# Altium project Metlino.PrjPcb (part 7 of 13)

## Sheet Metlino_CLK_Distribution.SchDoc: Metlino
size 420 x 297 mm; CheckedBy: P.Kulik,T.Przywozki,W.Ruclo; Author: G.Kasprowicz; CompanyName: WUT ISE; DrawnBy: G.Kasprowicz; Organization: WUT ISE; Address1: PW ISE; Address2: Nowowiejska 15/19 00-665 Warsaw; Address3: gkasprow@gmail.com; DocumentNumber: 13; Revision: 2; SheetNumber: 13; SheetTotal: 29; ModifiedBy: -; CheckedDate: -; Title2: Clock distribution; DivGrp: WUT ISE; Designer: G.Kasprowicz; ModifiedDate: -; ProjectName: Sensor Box
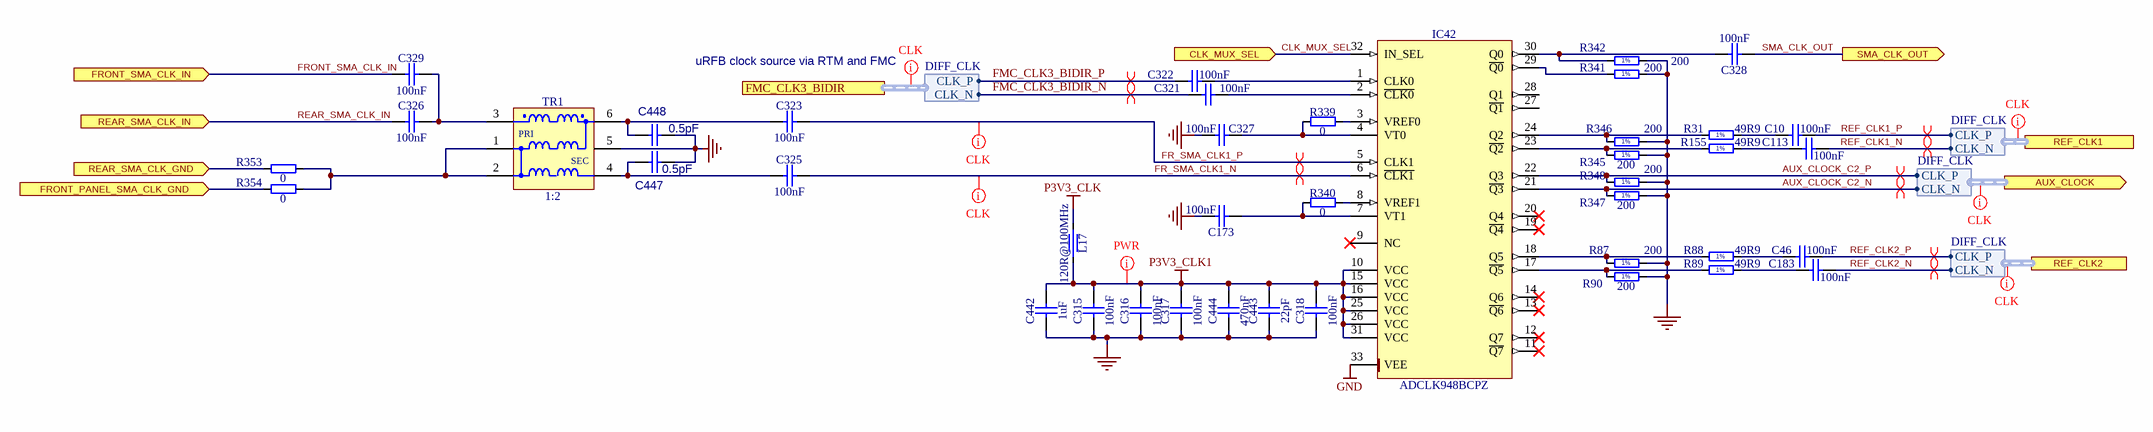
[diagram p13: Metlino_CLK_Distribution.SchDoc]

### Parts
C10  100nF  [CAPC0603X33N]
C46  100nF  [CAPC0603X33N]
C113  100nF  [CAPC0603X33N]
C173  100nF  [CAPC0603X33N]
C183  100nF  [CAPC0603X33N]
C315  100nF  [CAPC0603X33N]
C316  100nF  [CAPC0603X33N]
C317  100nF  [CAPC0603X33N]
C318  100nF  [CAPC0603X33N]
C321  100nF  [CAPC0603X33N]
C322  100nF  [CAPC0603X33N]
C323  100nF  [CAPC0603X33N]
C325  100nF  [CAPC0603X33N]
C326  100nF  [CAPC0603X33N]
C327  100nF  [CAPC0603X33N]
C328  100nF  [CAPC0603X33N]
C329  100nF  [CAPC0603X33N]
C442  1uF  [CAPC1005X55N]
C443  22pF  [CAPC1005X55N]
C444  470nF  [CAPC1005X55N]
C447  0.5pF  [CAPC1005X55N]
C448  0.5pF  [CAPC1005X55N]
IC42  ADCLK948BCPZ  [QFN50P500X500X80-33N-S285]
L17  120R@100MHz  [INDC1608X95N]
R31  49R9  [RESC1005X40N]
R87  200  [RESC1005X40N]
R88  49R9  [RESC1005X40N]
R89  49R9  [RESC1005X40N]
R90  200  [RESC1005X40N]
R155  49R9  [RESC1005X40N]
R339  0  [RESC1005X40N]
R340  0  [RESC1005X40N]
R341  200  [RESC1005X40N]
R342  200  [RESC1005X40N]
R345  200  [RESC1005X40N]
R346  200  [RESC1005X40N]
R347  200  [RESC1005X40N]
R348  200  [RESC1005X40N]
R353  0  [RESC1005X40N]
R354  0  [RESC1005X40N]
TR1  1:2  [XFMR_MINI-CIRCUITS_DB1627]

### Ports
AUX_CLOCK (out, harness DIFF_CLK), CLK_MUX_SEL (in), FMC_CLK3_BIDIR (harness DIFF_CLK), FRONT_PANEL_SMA_CLK_GND (in), FRONT_SMA_CLK_IN (in), REAR_SMA_CLK_GND (in), REAR_SMA_CLK_IN (in), REF_CLK1 (harness DIFF_CLK), REF_CLK2 (harness DIFF_CLK), SMA_CLK_OUT (out)

### Harnesses
DIFF_CLK: CLK_N, CLK_P

### Nets
GND: C173.2 C315.1 C316.1 C317.1 C318.1 C327.2 C442.2 C443.1 C444.1 C447.2 C448.2 IC42.33(VEE) R87.2 R90.2 R341.2 R342.2 R345.2 R346.2 R347.2 R348.2 TR1.5(NC)
P3V3_CLK: L17.1
P3V3_CLK1: C315.2 C316.2 C317.2 C318.2 C442.1 C443.2 C444.2 IC42.10(VCC) IC42.15(VCC) IC42.16(VCC) IC42.25(VCC) IC42.26(VCC) IC42.31(VCC) L17.2
AUX_CLOCK_C2_N: IC42.21(~{Q3}) R347.1 ; port AUX_CLOCK.CLK_N
AUX_CLOCK_C2_P: IC42.22(Q3) R348.1 ; port AUX_CLOCK.CLK_P
CLK_MUX_SEL: IC42.32(IN_SEL) ; port CLK_MUX_SEL
FMC_CLK3_BIDIR_N: C321.2 ; port FMC_CLK3_BIDIR.CLK_N  [project net CLK3_BIDIR_N]
FMC_CLK3_BIDIR_P: C322.2 ; port FMC_CLK3_BIDIR.CLK_P  [project net CLK3_BIDIR_P]
FR_SMA_CLK1_N: C325.2 IC42.6(~{CLK1})
FR_SMA_CLK1_P: C323.2 IC42.5(CLK1)
FRONT_PANEL_SMA_CLK_GND: R354.1 ; port FRONT_PANEL_SMA_CLK_GND
FRONT_SMA_CLK_IN: C329.1 ; port FRONT_SMA_CLK_IN
REAR_SMA_CLK_GND: R353.1 ; port REAR_SMA_CLK_GND
REAR_SMA_CLK_IN: C326.1 ; port REAR_SMA_CLK_IN
REF_CLK1_N: C113.1 ; port REF_CLK1.CLK_N
REF_CLK1_P: C10.1 ; port REF_CLK1.CLK_P
REF_CLK2_N: C183.1 ; port REF_CLK2.CLK_N
REF_CLK2_P: C46.1 ; port REF_CLK2.CLK_P
SMA_CLK_OUT: C328.1 ; port SMA_CLK_OUT
NetC10_2: C10.2 R31.2
NetC46_2: C46.2 R88.2
NetC113_2: C113.2 R155.2
NetC173_1: C173.1 IC42.7(VT1) R340.1
NetC183_2: C183.2 R89.2
NetC321_1: C321.1 IC42.2(~{CLK0})
NetC322_1: C322.1 IC42.1(CLK0)
NetC323_1: C323.1 C448.1 TR1.6(S1)
NetC325_1: C325.1 C447.1 TR1.4(S1)
NetC326_2: C326.2 C329.2 TR1.3(P1)
NetC327_1: C327.1 IC42.4(VT0) R339.1
NetC328_2: C328.2 IC42.30(Q0) R342.1
NetIC42_3: IC42.3(VREF0) R339.2
NetIC42_8: IC42.8(VREF1) R340.2
NetIC42_17: IC42.17(~{Q5}) R89.1 R90.1
NetIC42_18: IC42.18(Q5) R87.1 R88.1
NetIC42_23: IC42.23(~{Q2}) R155.1 R345.1
NetIC42_24: IC42.24(Q2) R31.1 R346.1
NetIC42_29: IC42.29(~{Q0}) R341.1
NetR353_2: R353.2 R354.2 TR1.1(P1) TR1.2(P1)

Not connected (* = marked no-connect by the designer): IC42 9(NC)* 11(~{Q7})* 12(Q7)* 13(~{Q6})* 14(Q6)* 19(~{Q4})* 20(Q4)* 27(~{Q1}) 28(Q1)

### Layout directives
differential pair: AUX_CLOCK_C2_N, AUX_CLOCK_C2_P, CLK3_BIDIR_N, CLK3_BIDIR_P, FR_SMA_CLK1_N, FR_SMA_CLK1_P, REF_CLK1_N, REF_CLK1_P, REF_CLK2_N, REF_CLK2_P
net class CLK: (no net found under the mark), FR_SMA_CLK1_N, FR_SMA_CLK1_P
net class PWR: P3V3_CLK1

### Notes on the sheet
- uRFB clock source via RTM and FMC
- Project/Equipment
- Document
- Designer
- Drawn by
- Check.by
- Copyright WUT ISE 2018.
  This documentation describes Open Hardware and is licensed under the CERN OHL v.1.1. You may redistribute and modify this documentation under the terms of the CERN OHL v.1.1. (http://ohwr.org/CERNOHL). This documentation is distributed WITHOUT ANY EXPRESS OR IMPLIED WARRANTY, INCLUDING OF MERCHANTABILITY, SATISFACTORY QUALITY AND FITNESS FOR A PARTICULAR PURPOSE. Please see the CERN OHL v.1.1 for applicable conditions.
- Contact
- File
- Last Mod.
- Print Date
- Sheet
- Size
- A3
- of
- Rev
- (in symbol R0402_49R9_1%_0.0625W_100PPM) 1%
- (in symbol R0402_200R_1%_0.0625W_100PPM) 1%
- (in symbol XFMR_MINI-CIRCUITS_TCM2-43X+) PRI; SEC

### Library data of the parts
C10 C46 C113 C173 C183 C315-C318 C321-C323 C325-C329 = CC0201_100NF_6.3V_10%_X5R: Non-polarised capacitor; Manufacturer: GENERIC; Part Description: SMD Multilayer Chip Ceramic Capacitor; Manufacturer1 Part Number: 02016D104KAT2A; Tolerance: ±10%; Voltage: 6.3V; TC: X5R; Manufacturer Part Number: CC0201_100NF_6.3V_10%_X5R; Part Number: CC0201_100NF_6.3V_10%_X5R; Value: 100nF; Component Kind: Standard; Component Type: Standard; Pin Count: 2; Status: Not Recommended; Case: 0201; Mounted: Yes; Socket: No; SMD: Yes; Sense: No; Manufacturer1 Example: AVX; Manufacturer1 ComponentHeight: 0.33mm; HelpURL: \\cern.ch\dfs\Applications\Altium\Datasheets\CC0201_X5R_AVX.pdf; Author: CERN DEM JLC; CreateDate: 03.12.2007; LatestRevisionDate: 03.12.2007
C442 = CC0402_1UF_16V_10%_X5R: as C215-C218 on sheet PWR_DC_DC_EXAR; Manufacturer Part Number: CC0402_1UF_16V_10%_X5R; Part Number: CC0402_1UF_16V_10%_X5R; Value: 1uF; Component Kind: Standard; Component Type: Standard; Pin Count: 2; Status: Preferred; Case: 0402; Mounted: Yes; Socket: No; SMD: Yes; Sense: No; Manufacturer1 Example: TDK; Manufacturer1 ComponentHeight: 0.55mm; HelpURL: \\cern.ch\dfs\Applications\Altium\Datasheets\CC0402_X5R_TDK_C.pdf; Author: CERN DEM JLC; CreateDate: 25.10.2012; LatestRevisionDate: 25.10.2012
C443 = CC0402_22PF_50V_5%_C0G: Non-polarised capacitor; Manufacturer: GENERIC; Part Description: SMD Multilayer Chip Ceramic Capacitor; Manufacturer1 Part Number: C0402C220J5GACTU; Tolerance: ±5%; Voltage: 50V; TC: C0G/NP0; Manufacturer Part Number: CC0402_22PF_50V_5%_C0G; Part Number: CC0402_22PF_50V_5%_C0G; Value: 22pF; Component Kind: Standard; Component Type: Standard; Pin Count: 2; Status: Preferred; Case: 0402; Mounted: Yes; Socket: No; SMD: Yes; Sense: No; Manufacturer1 Example: KEMET; Manufacturer1 ComponentHeight: 0.55mm; HelpURL: \\cern.ch\dfs\Applications\Altium\Datasheets\CC0805_C0G_KEMET_(Commercial Grade).pdf; Author: CERN DEM JLC; CreateDate: 03.12.2007; LatestRevisionDate: 03.12.2007
C444 = CC0402_470NF_16V_10%_X5R: Non-polarised capacitor; Manufacturer: GENERIC; Part Description: SMD Multilayer Chip Ceramic Capacitor; Manufacturer1 Part Number: C1005X5R1C105KT; Tolerance: ±10%; Voltage: 16V; TC: X5R; Manufacturer Part Number: CC0402_470NF_16V_10%_X5R; Part Number: CC0402_470NF_16V_10%_X5R; Value: 470nF; Component Kind: Standard; Component Type: Standard; Pin Count: 2; Status: Preferred; Case: 0402; Mounted: Yes; Socket: No; SMD: Yes; Sense: No; Manufacturer1 Example: TDK; Manufacturer1 ComponentHeight: 0.55mm; HelpURL: \\cern.ch\dfs\Applications\Altium\Datasheets\CC0402_X5R_TDK_C.pdf; Author: CERN DEM JLC; CreateDate: 25.10.2012; LatestRevisionDate: 25.10.2012
C447 = CAPC1005X55N: $$NotCommonProperty_General Part Number: CC0402_0.5PF_25V_0.25PF_C0G; $$NotCommonProperty_Manufacturer1 Example: AVX; $$NotCommonProperty_Manufacturer1 Part Number: 04023J0R5ABSTR; Manufacturer Part Number: CC0402_0.5PF_25V_0.05PF_C0G; Manufacturer: GENERIC; Part Description: SMD Multilayer Chip Ceramic Capacitor; Part Name: Capacitor - non polarized CAPC1005X55N; $$Internal_Resolution: 00001mm; $$NotCommonProperty_Case: 0402; $$NotCommonProperty_Pin Count: 2; $$NotCommonProperty_SMD: Yes; $$NotCommonProperty_Status: Preferred; $$NotCommonProperty_TC: C0G/NP0; $$NotCommonProperty_Voltage: 25V; CmpIndex: 53; DXDB_LIBNAME: Capacitors SMD; Ref Designator: C447; SymIndex: 331; Tolerance: ±0.05pF; Cell Name: CAPC1005X55N; Part Number: Capacitor - non polarized CAPC1005X55N; Value: 0.5pF; Orientation: 0 = 0
C448 = CAPC1005X55N: $$NotCommonProperty_General Part Number: CC0402_0.5PF_25V_0.25PF_C0G; $$NotCommonProperty_Manufacturer1 Example: AVX; $$NotCommonProperty_Manufacturer1 Part Number: 04023J0R5ABSTR; Manufacturer Part Number: CC0402_0.5PF_25V_0.05PF_C0G; Manufacturer: GENERIC; Part Description: SMD Multilayer Chip Ceramic Capacitor; Part Name: Capacitor - non polarized CAPC1005X55N; $$Internal_Resolution: 00001mm; $$NotCommonProperty_Case: 0402; $$NotCommonProperty_Pin Count: 2; $$NotCommonProperty_SMD: Yes; $$NotCommonProperty_Status: Preferred; $$NotCommonProperty_TC: C0G/NP0; $$NotCommonProperty_Voltage: 25V; CmpIndex: 57; DXDB_LIBNAME: Capacitors SMD; Ref Designator: C448; SymIndex: 331; Tolerance: ±0.05pF; Cell Name: CAPC1005X55N; Part Number: Capacitor - non polarized CAPC1005X55N; Value: 0.5pF; Orientation: 0 = 0
IC42 = ADCLK948BCPZ: Two Selectable Inputs, 8 LVPECL Outputs, SiGe Clock Fanout Buffer; Manufacturer: ANALOG DEVICES; PressFit: No; Bonding: No; Manufacturer Part Number: ADCLK948BCPZ; PackageDescription: QFN, 0.50mm Pitch, Square; 8 Pin X 8 Pin, 5mm X 5mm X 1.00mm H body (w/thermal tab 2.85 X 2.85mm),  IPC Medium Density; Part Description: Two Selectable Inputs, 8 LVPECL Outputs, SiGe Clock Fanout Buffer; Part Number: ADCLK948BCPZ; Component Kind: Standard; Component Type: Standard; Device: ADCLK948BCPZ; Pin Count: 33; Case: QFN32; Mounted: Yes; Socket: No; SMD: Yes; Sense: No; ComponentHeight: 0.8mm; Author: CERN DEM MR; HelpURL: \\cern.ch\dfs\Applications\Altium\Datasheets\ADCLK948BCPZ.pdf; CreateDate: 30.11.2016; LatestRevisionDate: 30.11.2016
L17 = IND0603_MURATA_BLM18PG121SN1D: Manufacturer: MURATA; Part Description: SMD EMIFIL Chip Ferrite Bead; Power: 2A; Resistance: 0.05R; Manufacturer Part Number: BLM18PG121SN1D; Part Number: IND0603_MURATA_BLM18PG121SN1D; Value: 120R@100MHz; Component Kind: Standard; Component Type: Standard; Pin Count: 2; Status: None; Case: 0603; Mounted: Yes; Socket: No; SMD: Yes; Sense: No; ComponentHeight: 0.95mm; HelpURL: \\cern.ch\dfs\Applications\Altium\Datasheets\IND0603_MURATA_BLM18P.pdf; Author: CERN DEM BC; CreateDate: 27.07.2015; LatestRevisionDate: 25.10.2018
R31 R88 R89 R155 = R0402_49R9_1%_0.0625W_100PPM: Resistor - 1%; Manufacturer: GENERIC; Part Description: General Purpose Thick Film Chip Resistor; Manufacturer1 Part Number: 232270674999L or RC0402FR-0749R9L; TC: ±100ppm/°C; PressFit: No; Manufacturer Part Number: R0402_49R9_1%_0.0625W_100PPM; Part Number: R0402_49R9_1%_0.0625W_100PPM; Tolerance: ±1%; Value: 49R9; Component Kind: Standard; Component Type: Standard; Pin Count: 2; Status: Not Recommended; Power: 0.0625W; Case: 0402; Mounted: Yes; Sense: No; Socket: No; SMD: Yes; Manufacturer1 Example: YAGEO PHYCOMP; Manufacturer1 ComponentHeight: 0.4mm; HelpURL: \\cern.ch\dfs\Applications\Altium\Datasheets\R0402_Phycomp_RC0402.pdf; Author: CERN DEM JLC; CreateDate: 24.10.2012; LatestRevisionDate: 24.10.2012
R87 R90 R341 R342 R345-R348 = R0402_200R_1%_0.0625W_100PPM: Resistor - 1%; Manufacturer: GENERIC; Part Description: General Purpose Thick Film Chip Resistor; Manufacturer1 Part Number: 232270672001L; TC: ±100ppm/°C; PressFit: No; Manufacturer Part Number: R0402_200R_1%_0.0625W_100PPM; Part Number: R0402_200R_1%_0.0625W_100PPM; Tolerance: ±1%; Value: 200; Component Kind: Standard; Component Type: Standard; Pin Count: 2; Status: Not Recommended; Power: 0.0625W; Case: 0402; Mounted: Yes; Sense: No; Socket: No; SMD: Yes; Manufacturer1 Example: YAGEO PHYCOMP; Manufacturer1 ComponentHeight: 0.4mm; HelpURL: \\cern.ch\dfs\Applications\Altium\Datasheets\R0402_Phycomp_RC0402.pdf; Author: CERN DEM JLC; CreateDate: 03.12.2007; LatestRevisionDate: 17.10.2012
R339 R340 R353 R354 = R0402_0R_JUMPER: Resistor; Manufacturer: GENERIC; Part Description: 1A (0.05R Max DC Resistance) Zero Ohm Jumper; Manufacturer1 Part Number: 232270591001L; PressFit: No; Manufacturer Part Number: R0402_0R_JUMPER; Part Number: R0402_0R_JUMPER; Value: 0; Component Kind: Standard; Component Type: Standard; Pin Count: 2; Status: Not Recommended; Case: 0402; Mounted: Yes; Sense: No; Socket: No; SMD: Yes; Manufacturer1 Example: YAGEO PHYCOMP; Manufacturer1 ComponentHeight: 0.4mm; HelpURL: \\cern.ch\dfs\Applications\Altium\Datasheets\R0402_Phycomp_RC0402.pdf; Author: CERN DEM JLC; CreateDate: 03.12.2007; LatestRevisionDate: 17.10.2012
TR1 = XFMR_MINI-CIRCUITS_TCM2-43X+: 50 OHMS 10 to 4000 MHz RF Transformer; Power: 0.4W; Part Number: XFMR_MINI-CIRCUITS_TCM2-43X+; Component Kind: Standard; Component Type: Standard; Pin Count: 6; Value: 1:2; Status: None; Part Description: 50 Ohms 10 to 4000MHz RF Transformer; Manufacturer: MINI-CIRCUITS; Manufacturer Part Number: TCM2-43X+; Mounted: Yes; Socket: No; Sense: No; SMD: Yes; ComponentHeight: 4.06mm; HelpURL: \\cern.ch\dfs\Applications\Altium\Datasheets\XFMR_MINI-CIRCUITS_TCM2-43X+.pdf; Author: CERN DEM BC; CreateDate: 12.02.2016; LatestRevisionDate: 12.02.2016

## Sheet Thermometers.SchDoc: Metlino
size 420 x 297 mm; CheckedBy: P.Kulik,T.Przywozki,W.Ruclo; Author: G.Kasprowicz; CompanyName: WUT ISE; DrawnBy: G.Kasprowicz; Organization: WUT ISE; Address1: PW ISE; Address2: Nowowiejska 15/19 00-665 Warsaw; Address3: gkasprow@gmail.com; DocumentNumber: 24; Revision: 2; SheetNumber: 24; SheetTotal: 29; ModifiedBy: -; CheckedDate: -; Title2: Sensors & EEPROM; DivGrp: WUT ISE; Designer: G.Kasprowicz; ModifiedDate: -; ProjectName: Sensor Box
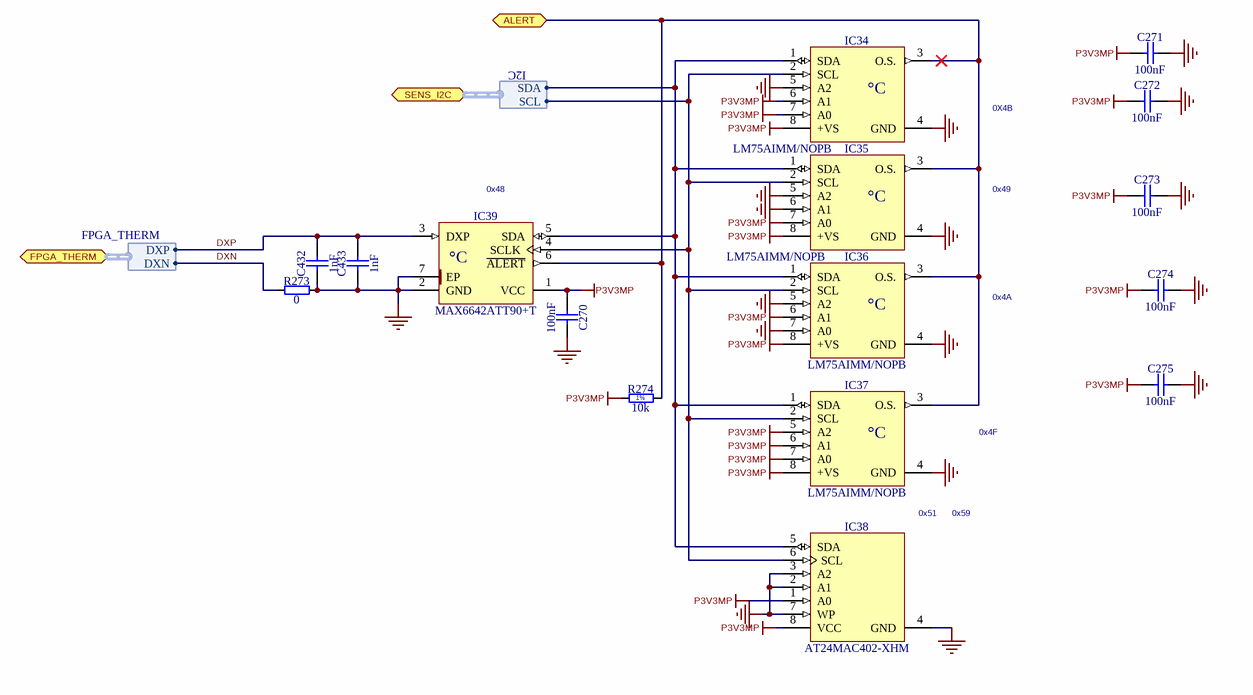
[diagram p14: Thermometers.SchDoc]

### Parts
C270  100nF  [CAPC0603X33N]
C271  100nF  [CAPC0603X33N]
C272  100nF  [CAPC0603X33N]
C273  100nF  [CAPC0603X33N]
C274  100nF  [CAPC0603X33N]
C275  100nF  [CAPC0603X33N]
C432  1nF  [CAPC1005X55N]
C433  1nF  [CAPC1005X55N]
IC34  LM75AIMM/NOPB  [SOP65P490X109-8N]
IC35  LM75AIMM/NOPB  [SOP65P490X109-8N]
IC36  LM75AIMM/NOPB  [SOP65P490X109-8N]
IC37  LM75AIMM/NOPB  [SOP65P490X109-8N]
IC38  AT24MAC402-XHM  [SOP65P640X120-8N]
IC39  MAX6642ATT90+T  [SON95P300X300X80-7N-R160X240]
R273  0  [RESC1005X40N]
R274  10k  [RESC1005X40N]

### Ports
ALERT (bidir), FPGA_THERM (bidir, harness FPGA_THERM), SENS_I2C (bidir, harness I2C)

### Harnesses
FPGA_THERM: DXP, DXN
I2C: SCL, SDA

### Nets
GND: C270.1 C271.2 C272.2 C273.2 C274.2 C275.2 C432.1 C433.1 IC34.4(GND) IC34.5(A2) IC35.4(GND) IC35.5(A2) IC35.6(A1) IC36.4(GND) IC36.5(A2) IC36.7(A0) IC37.4(GND) IC38.2(A1) IC38.3(A2) IC38.4(GND) IC38.7(WP) IC39.2(GND) IC39.7(EP) R273.2
P3V3MP: C270.2 C271.1 C272.1 C273.1 C274.1 C275.1 IC34.6(A1) IC34.7(A0) IC34.8(+VS) IC35.7(A0) IC35.8(+VS) IC36.6(A1) IC36.8(+VS) IC37.5(A2) IC37.6(A1) IC37.7(A0) IC37.8(+VS) IC38.1(A0) IC38.8(VCC) IC39.1(VCC) R274.1
DXN: R273.1 ; port FPGA_THERM.DXN
DXP: C432.2 C433.2 IC39.3(DXP) ; port FPGA_THERM.DXP
PM_I2C.SCL: IC34.2(SCL) IC35.2(SCL) IC36.2(SCL) IC37.2(SCL) IC38.6(SCL) IC39.4(SCLK) ; port SENS_I2C.SCL
PM_I2C.SDA: IC34.1(SDA) IC35.1(SDA) IC36.1(SDA) IC37.1(SDA) IC38.5(SDA) IC39.5(SDA) ; port SENS_I2C.SDA
NetIC34_3: IC34.3(O.S.) IC35.3(O.S.) IC36.3(O.S.) IC37.3(O.S.) IC39.6(~{ALERT}) R274.2 ; port ALERT

### Notes on the sheet
- 0X4B
- (near IC39) 0x48
- 0x49
- 0x4A
- 0x4F
- 0x51
- 0x59
- Project/Equipment
- Document
- Designer
- Drawn by
- Check.by
- Copyright WUT ISE 2018.
  This documentation describes Open Hardware and is licensed under the CERN OHL v.1.1. You may redistribute and modify this documentation under the terms of the CERN OHL v.1.1. (http://ohwr.org/CERNOHL). This documentation is distributed WITHOUT ANY EXPRESS OR IMPLIED WARRANTY, INCLUDING OF MERCHANTABILITY, SATISFACTORY QUALITY AND FITNESS FOR A PARTICULAR PURPOSE. Please see the CERN OHL v.1.1 for applicable conditions.
- Contact
- File
- Last Mod.
- Print Date
- Sheet
- Size
- A3
- of
- Rev
- (in symbol LM75AIMM/NOPB) °C
- (in symbol MAX6642ATT90+T) °C
- (in symbol R0402_10K_1%_0.0625W_100PPM) 1%

### Library data of the parts
C270-C275 = CC0201_100NF_6.3V_10%_X5R: as C10 on sheet Metlino_CLK_Distribution; Manufacturer Part Number: CC0201_100NF_6.3V_10%_X5R; Part Number: CC0201_100NF_6.3V_10%_X5R; Value: 100nF; Component Kind: Standard; Component Type: Standard; Pin Count: 2; Status: Not Recommended; Case: 0201; Mounted: Yes; Socket: No; SMD: Yes; Sense: No; Manufacturer1 Example: AVX; Manufacturer1 ComponentHeight: 0.33mm; HelpURL: \\cern.ch\dfs\Applications\Altium\Datasheets\CC0201_X5R_AVX.pdf; Author: CERN DEM JLC; CreateDate: 03.12.2007; LatestRevisionDate: 03.12.2007
C432 C433 = CC0402_1NF_50V_10%_X7R: Non-polarised capacitor; Manufacturer: GENERIC; Part Description: SMD Multilayer Chip Ceramic Capacitor; Manufacturer1 Part Number: 223858715623; Tolerance: ±10%; Voltage: 50V; TC: X7R; Manufacturer Part Number: CC0402_1NF_50V_10%_X7R; Part Number: CC0402_1NF_50V_10%_X7R; Value: 1nF; Component Kind: Standard; Component Type: Standard; Pin Count: 2; Status: Not Recommended; Case: 0402; Mounted: Yes; Socket: No; SMD: Yes; Sense: No; Manufacturer1 Example: PHYCOMP; Manufacturer1 ComponentHeight: 0.55mm; HelpURL: \\cern.ch\dfs\Applications\Altium\Datasheets\CC0402_X7R_PHYCOMP.pdf; Author: CERN DEM JLC; CreateDate: 03.12.2007; LatestRevisionDate: 03.12.2007
IC34-IC37 = LM75AIMM/NOPB: Digital Temperature Sensor and Thermal Watchdog with Two-Wire Interface; Manufacturer: TEXAS INSTRUMENTS; Part Description: -25° to +100°C ±2°C Digital Temperature Sensor and Thermal Watchdog with Two-Wire Interface; PressFit: No; Bonding: No; Manufacturer Part Number: LM75AIMM/NOPB; PackageDescription: SOP, 0.65mm pitch; 8 pin,3.00mm W X 3.00mm L X 1.09mm H bodyI, PC Medium Density; Part Number: LM75AIMM/NOPB; Component Kind: Standard; Component Type: Standard; Device: LM75AIMM/NOPB; Pin Count: 8; Case: SSOP8; Mounted: Yes; Socket: No; SMD: Yes; Sense: No; ComponentHeight: 1.09mm; HelpURL: \\cern.ch\dfs\Applications\Altium\Datasheets\LM75AIMM-NOPB.pdf; Author: CERN DEM JLC; CreateDate: 15.10.2012; LatestRevisionDate: 15.10.2012
IC38 = AT24MAC402-XHM: 1.7V to 5.5V, I2C-Compatible (2-wire) 2-Kbit (256 x 8) Serial EEPROM; Manufacturer: ATMEL; Part Description: 1.7V to 5.5V, I2C-Compatible (2-wire) 2-Kbit (256 x 8) Serial EEPROM with a EUI-48 Address; PressFit: No; Bonding: No; Footprint: SOP65X640X120-8N; Manufacturer Part Number: AT24MAC402-XHM; PackageDescription: SOP, 0.65mm pitch; 8 pin, 4.40mm W X 3.00mm L X 1.20mm H body, IPC Medium Density; Part Number: AT24MAC402-XHM; Component Kind: Standard; Component Type: Standard; Device: AT24MAC402-XHM; Pin Count: 8; Case: TSSOP8; Mounted: Yes; Socket: No; SMD: Yes; Sense: No; ComponentHeight: 1.2mm; HelpURL: \\cern.ch\dfs\Applications\Altium\Datasheets\AT24MAC402-XHM.pdf; Author: CERN DEM MR; CreateDate: 09.03.2016; LatestRevisionDate: 09.11.2016
IC39 = MAX6642ATT90+T: ±1°C, SMBus-Compatible Remote/Local Temperature Sensor with Overtemperature Alarm; Manufacturer: MAXIM; Part Description: 0°C to +125°C, ±1°C, SMBus-Compatible Remote/Local Temperature Sensor with Overtemperature Alarm (Address 1001 000); PressFit: No; Bonding: No; Manufacturer Part Number: MAX6642ATT90+T; PackageDescription: SON, 0.95mm Pitch; 6 Pin, 3.00mm W X 3mm L X 0.80mm H body (w/Thermal Tab 1.6mm x 2.4mm); Part Number: MAX6642ATT90+T; Component Kind: Standard; Component Type: Standard; Device: MAX6642ATT90+T; Pin Count: 7; Case: SON6; Mounted: Yes; Socket: No; SMD: Yes; Sense: No; ComponentHeight: 0.8mm; HelpURL: \\cern.ch\dfs\Applications\Altium\Datasheets\MAX6642ATT90+T.pdf; Author: CERN DEM JLC; CreateDate: 26.11.2013; LatestRevisionDate: 26.11.2013
R273 = R0402_0R_JUMPER: as R339 on sheet Metlino_CLK_Distribution; Manufacturer Part Number: R0402_0R_JUMPER; Part Number: R0402_0R_JUMPER; Value: 0; Component Kind: Standard; Component Type: Standard; Pin Count: 2; Status: Not Recommended; Case: 0402; Mounted: Yes; Sense: No; Socket: No; SMD: Yes; Manufacturer1 Example: YAGEO PHYCOMP; Manufacturer1 ComponentHeight: 0.4mm; HelpURL: \\cern.ch\dfs\Applications\Altium\Datasheets\R0402_Phycomp_RC0402.pdf; Author: CERN DEM JLC; CreateDate: 03.12.2007; LatestRevisionDate: 17.10.2012
R274 = R0402_10K_1%_0.0625W_100PPM: Resistor - 1%; Manufacturer: GENERIC; Part Description: General Purpose Thick Film Chip Resistor; Manufacturer1 Part Number: 232270671003L; TC: ±100ppm/°C; PressFit: No; Manufacturer Part Number: R0402_10K_1%_0.0625W_100PPM; Part Number: R0402_10K_1%_0.0625W_100PPM; Tolerance: ±1%; Value: 10k; Component Kind: Standard; Component Type: Standard; Pin Count: 2; Status: Not Recommended; Power: 0.0625W; Case: 0402; Mounted: Yes; Sense: No; Socket: No; SMD: Yes; Manufacturer1 Example: YAGEO PHYCOMP; Manufacturer1 ComponentHeight: 0.4mm; HelpURL: \\cern.ch\dfs\Applications\Altium\Datasheets\R0402_Phycomp_RC0402.pdf; Author: CERN DEM JLC; CreateDate: 03.12.2007; LatestRevisionDate: 17.10.2012

## Sheet VHDCI_CON.SchDoc: Metlino
size 420 x 297 mm; CheckedBy: P.Kulik,T.Przywozki,W.Ruclo; Author: G.Kasprowicz; CompanyName: WUT ISE; DrawnBy: G.Kasprowicz; Organization: WUT ISE; Address1: PW ISE; Address2: Nowowiejska 15/19 00-665 Warsaw; Address3: gkasprow@gmail.com; DocumentNumber: 14; Revision: 2; SheetNumber: 14; SheetTotal: 29; ModifiedBy: -; CheckedDate: -; Title2: VHDCI connectors; DivGrp: WUT ISE; Designer: G.Kasprowicz; ModifiedDate: -; ProjectName: Sensor Box
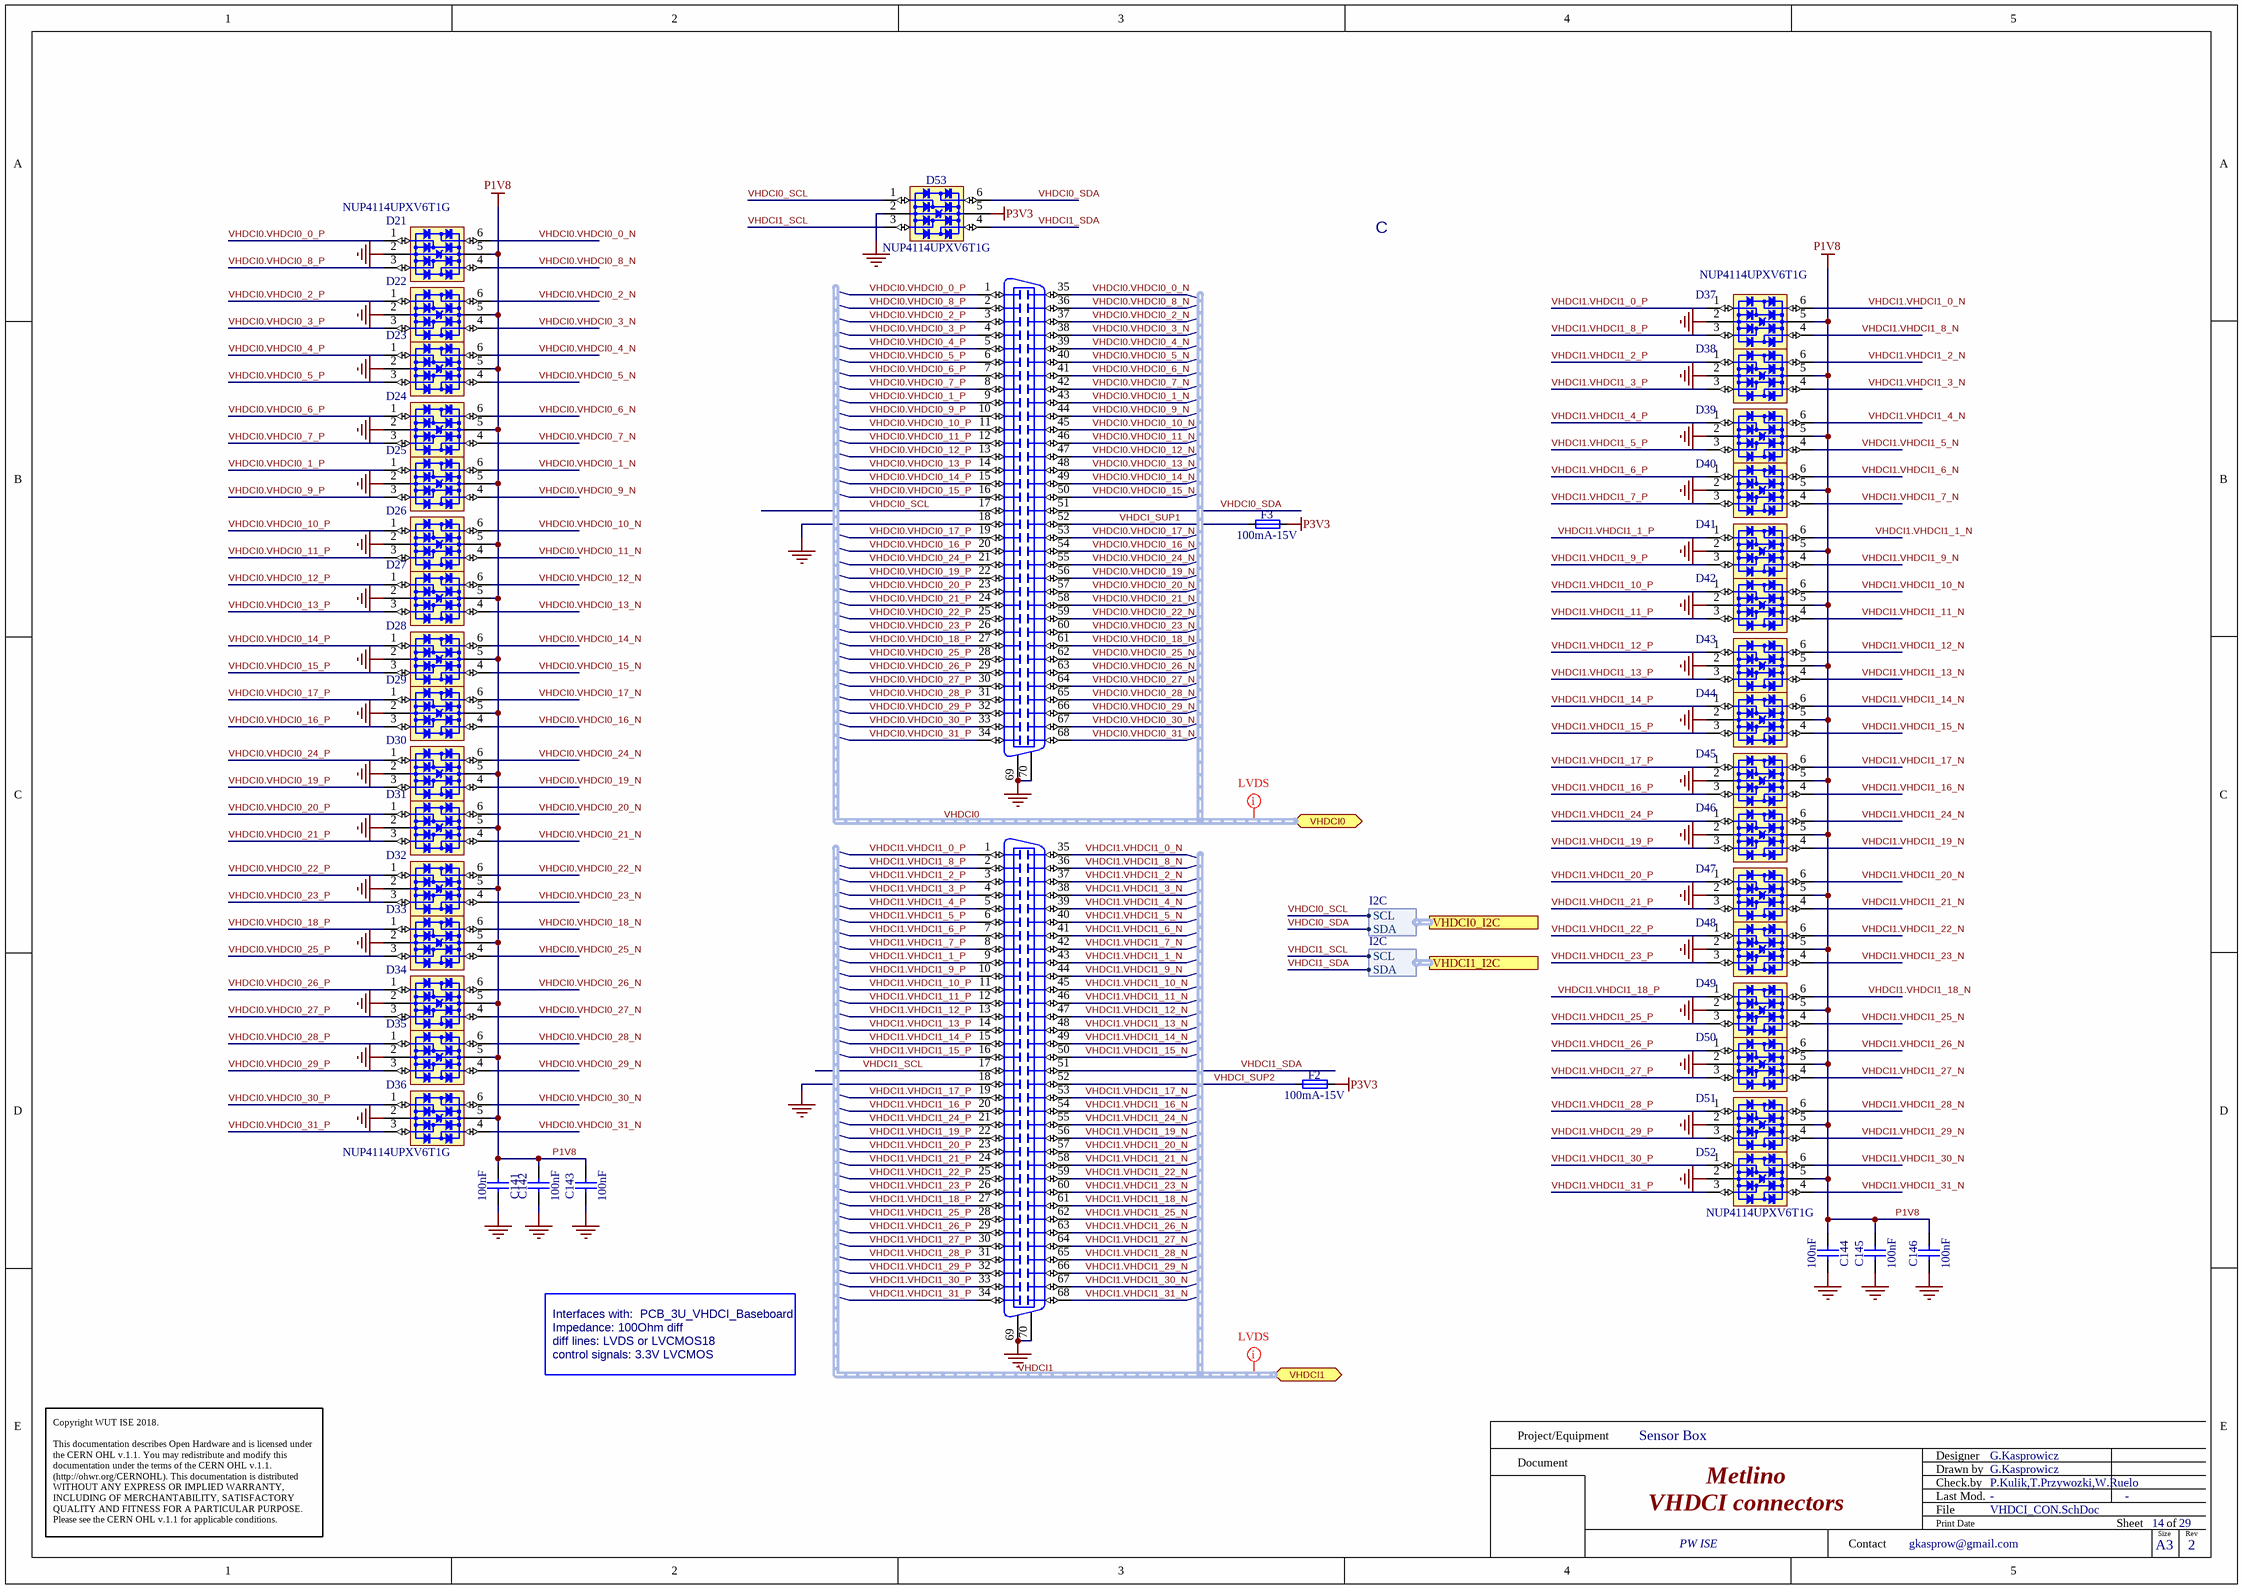
[diagram p15: VHDCI_CON.SchDoc]

### Parts
C141  100nF  [CAPC0603X33N]
C142  100nF  [CAPC0603X33N]
C143  100nF  [CAPC0603X33N]
C144  100nF  [CAPC0603X33N]
C145  100nF  [CAPC0603X33N]
C146  100nF  [CAPC0603X33N]
D21  NUP4114UPXV6T1G  [SOTFL50P160X60-6N]
D22  NUP4114UPXV6T1G  [SOTFL50P160X60-6N]  (value not drawn)
D23  NUP4114UPXV6T1G  [SOTFL50P160X60-6N]  (value not drawn)
D24  NUP4114UPXV6T1G  [SOTFL50P160X60-6N]  (value not drawn)
D25  NUP4114UPXV6T1G  [SOTFL50P160X60-6N]  (value not drawn)
D26  NUP4114UPXV6T1G  [SOTFL50P160X60-6N]  (value not drawn)
D27  NUP4114UPXV6T1G  [SOTFL50P160X60-6N]  (value not drawn)
D28  NUP4114UPXV6T1G  [SOTFL50P160X60-6N]  (value not drawn)
D29  NUP4114UPXV6T1G  [SOTFL50P160X60-6N]  (value not drawn)
D30  NUP4114UPXV6T1G  [SOTFL50P160X60-6N]  (value not drawn)
D31  NUP4114UPXV6T1G  [SOTFL50P160X60-6N]  (value not drawn)
D32  NUP4114UPXV6T1G  [SOTFL50P160X60-6N]  (value not drawn)
D33  NUP4114UPXV6T1G  [SOTFL50P160X60-6N]  (value not drawn)
D34  NUP4114UPXV6T1G  [SOTFL50P160X60-6N]  (value not drawn)
D35  NUP4114UPXV6T1G  [SOTFL50P160X60-6N]  (value not drawn)
D36  NUP4114UPXV6T1G  [SOTFL50P160X60-6N]
D37  NUP4114UPXV6T1G  [SOTFL50P160X60-6N]
D38  NUP4114UPXV6T1G  [SOTFL50P160X60-6N]  (value not drawn)
D39  NUP4114UPXV6T1G  [SOTFL50P160X60-6N]  (value not drawn)
D40  NUP4114UPXV6T1G  [SOTFL50P160X60-6N]  (value not drawn)
D41  NUP4114UPXV6T1G  [SOTFL50P160X60-6N]  (value not drawn)
D42  NUP4114UPXV6T1G  [SOTFL50P160X60-6N]  (value not drawn)
D43  NUP4114UPXV6T1G  [SOTFL50P160X60-6N]  (value not drawn)
D44  NUP4114UPXV6T1G  [SOTFL50P160X60-6N]  (value not drawn)
D45  NUP4114UPXV6T1G  [SOTFL50P160X60-6N]  (value not drawn)
D46  NUP4114UPXV6T1G  [SOTFL50P160X60-6N]  (value not drawn)
D47  NUP4114UPXV6T1G  [SOTFL50P160X60-6N]  (value not drawn)
D48  NUP4114UPXV6T1G  [SOTFL50P160X60-6N]  (value not drawn)
D49  NUP4114UPXV6T1G  [SOTFL50P160X60-6N]  (value not drawn)
D50  NUP4114UPXV6T1G  [SOTFL50P160X60-6N]  (value not drawn)
D51  NUP4114UPXV6T1G  [SOTFL50P160X60-6N]  (value not drawn)
D52  NUP4114UPXV6T1G  [SOTFL50P160X60-6N]
D53  NUP4114UPXV6T1G  [SOTFL50P160X60-6N]
F2  100mA-15V  [FUSR_LITTELFUSE_0805L010]
F3  100mA-15V  [FUSR_LITTELFUSE_0805L010]
J14  VHDCI  [MOLEX_71430-0013]  (value not drawn)
J15  VHDCI  [MOLEX_71430-0013]  (value not drawn)

### Ports
VHDCI0 (bidir, harness VHDCI0), VHDCI0_I2C (harness I2C), VHDCI1 (bidir, harness VHDCI1), VHDCI1_I2C (harness I2C)

### Harnesses
I2C: SCL, SDA

### Nets
GND: C141.1 C142.1 C143.1 C144.1 C145.1 C146.1 D21.2(GND) D22.2(GND) D23.2(GND) D24.2(GND) D25.2(GND) D26.2(GND) D27.2(GND) D28.2(GND) D29.2(GND) D30.2(GND) D31.2(GND) D32.2(GND) D33.2(GND) D34.2(GND) D35.2(GND) D36.2(GND) D37.2(GND) D38.2(GND) D39.2(GND) D40.2(GND) D41.2(GND) D42.2(GND) D43.2(GND) D44.2(GND) D45.2(GND) D46.2(GND) D47.2(GND) D48.2(GND) D49.2(GND) D50.2(GND) D51.2(GND) D52.2(GND) D53.2(GND) J14.18 J14.69 J14.70 J15.18 J15.69 J15.70
P1V8: C141.2 C142.2 C143.2 C144.2 C145.2 C146.2 D21.5(VBUS) D22.5(VBUS) D23.5(VBUS) D24.5(VBUS) D25.5(VBUS) D26.5(VBUS) D27.5(VBUS) D28.5(VBUS) D29.5(VBUS) D30.5(VBUS) D31.5(VBUS) D32.5(VBUS) D33.5(VBUS) D34.5(VBUS) D35.5(VBUS) D36.5(VBUS) D37.5(VBUS) D38.5(VBUS) D39.5(VBUS) D40.5(VBUS) D41.5(VBUS) D42.5(VBUS) D43.5(VBUS) D44.5(VBUS) D45.5(VBUS) D46.5(VBUS) D47.5(VBUS) D48.5(VBUS) D49.5(VBUS) D50.5(VBUS) D51.5(VBUS) D52.5(VBUS)
P3V3: D53.5(VBUS) F2.2 F3.2
VHDCI0.VHDCI0_0_N: D21.6(I/O4) J14.35
VHDCI0.VHDCI0_0_P: D21.1(I/O1) J14.1
VHDCI0.VHDCI0_1_N: D25.6(I/O4) J14.43
VHDCI0.VHDCI0_1_P: D25.1(I/O1) J14.9
VHDCI0.VHDCI0_2_N: D22.6(I/O4) J14.37
VHDCI0.VHDCI0_2_P: D22.1(I/O1) J14.3
VHDCI0.VHDCI0_3_N: D22.4(I/O3) J14.38
VHDCI0.VHDCI0_3_P: D22.3(I/O2) J14.4
VHDCI0.VHDCI0_4_N: D23.6(I/O4) J14.39
VHDCI0.VHDCI0_4_P: D23.1(I/O1) J14.5
VHDCI0.VHDCI0_5_N: D23.4(I/O3) J14.40
VHDCI0.VHDCI0_5_P: D23.3(I/O2) J14.6
VHDCI0.VHDCI0_6_N: D24.6(I/O4) J14.41
VHDCI0.VHDCI0_6_P: D24.1(I/O1) J14.7
VHDCI0.VHDCI0_7_N: D24.4(I/O3) J14.42
VHDCI0.VHDCI0_7_P: D24.3(I/O2) J14.8
VHDCI0.VHDCI0_8_N: D21.4(I/O3) J14.36
VHDCI0.VHDCI0_8_P: D21.3(I/O2) J14.2
VHDCI0.VHDCI0_9_N: D25.4(I/O3) J14.44
VHDCI0.VHDCI0_9_P: D25.3(I/O2) J14.10
VHDCI0.VHDCI0_10_N: D26.6(I/O4) J14.45
VHDCI0.VHDCI0_10_P: D26.1(I/O1) J14.11
VHDCI0.VHDCI0_11_N: D26.4(I/O3) J14.46
VHDCI0.VHDCI0_11_P: D26.3(I/O2) J14.12
VHDCI0.VHDCI0_12_N: D27.6(I/O4) J14.47
VHDCI0.VHDCI0_12_P: D27.1(I/O1) J14.13
VHDCI0.VHDCI0_13_N: D27.4(I/O3) J14.48
VHDCI0.VHDCI0_13_P: D27.3(I/O2) J14.14
VHDCI0.VHDCI0_14_N: D28.6(I/O4) J14.49
VHDCI0.VHDCI0_14_P: D28.1(I/O1) J14.15
VHDCI0.VHDCI0_15_N: D28.4(I/O3) J14.50
VHDCI0.VHDCI0_15_P: D28.3(I/O2) J14.16
VHDCI0.VHDCI0_16_N: D29.4(I/O3) J14.54
VHDCI0.VHDCI0_16_P: D29.3(I/O2) J14.20
VHDCI0.VHDCI0_17_N: D29.6(I/O4) J14.53
VHDCI0.VHDCI0_17_P: D29.1(I/O1) J14.19
VHDCI0.VHDCI0_18_N: D33.6(I/O4) J14.61
VHDCI0.VHDCI0_18_P: D33.1(I/O1) J14.27
VHDCI0.VHDCI0_19_N: D30.4(I/O3) J14.56
VHDCI0.VHDCI0_19_P: D30.3(I/O2) J14.22
VHDCI0.VHDCI0_20_N: D31.6(I/O4) J14.57
VHDCI0.VHDCI0_20_P: D31.1(I/O1) J14.23
VHDCI0.VHDCI0_21_N: D31.4(I/O3) J14.58
VHDCI0.VHDCI0_21_P: D31.3(I/O2) J14.24
VHDCI0.VHDCI0_22_N: D32.6(I/O4) J14.59
VHDCI0.VHDCI0_22_P: D32.1(I/O1) J14.25
VHDCI0.VHDCI0_23_N: D32.4(I/O3) J14.60
VHDCI0.VHDCI0_23_P: D32.3(I/O2) J14.26
VHDCI0.VHDCI0_24_N: D30.6(I/O4) J14.55
VHDCI0.VHDCI0_24_P: D30.1(I/O1) J14.21
VHDCI0.VHDCI0_25_N: D33.4(I/O3) J14.62
VHDCI0.VHDCI0_25_P: D33.3(I/O2) J14.28
VHDCI0.VHDCI0_26_N: D34.6(I/O4) J14.63
VHDCI0.VHDCI0_26_P: D34.1(I/O1) J14.29
VHDCI0.VHDCI0_27_N: D34.4(I/O3) J14.64
VHDCI0.VHDCI0_27_P: D34.3(I/O2) J14.30
VHDCI0.VHDCI0_28_N: D35.6(I/O4) J14.65
VHDCI0.VHDCI0_28_P: D35.1(I/O1) J14.31
VHDCI0.VHDCI0_29_N: D35.4(I/O3) J14.66
VHDCI0.VHDCI0_29_P: D35.3(I/O2) J14.32
VHDCI0.VHDCI0_30_N: D36.6(I/O4) J14.67
VHDCI0.VHDCI0_30_P: D36.1(I/O1) J14.33
VHDCI0.VHDCI0_31_N: D36.4(I/O3) J14.68
VHDCI0.VHDCI0_31_P: D36.3(I/O2) J14.34
VHDCI0_SCL: D53.1(I/O1) J14.17 ; port VHDCI0_I2C.SCL  [project net SCL6]
VHDCI0_SDA: D53.6(I/O4) J14.51 ; port VHDCI0_I2C.SDA  [project net SDA6]
VHDCI1.VHDCI1_0_N: D37.6(I/O4) J15.35
VHDCI1.VHDCI1_0_P: D37.1(I/O1) J15.1
VHDCI1.VHDCI1_1_N: D41.6(I/O4) J15.43
VHDCI1.VHDCI1_1_P: D41.1(I/O1) J15.9
VHDCI1.VHDCI1_2_N: D38.6(I/O4) J15.37
VHDCI1.VHDCI1_2_P: D38.1(I/O1) J15.3
VHDCI1.VHDCI1_3_N: D38.4(I/O3) J15.38
VHDCI1.VHDCI1_3_P: D38.3(I/O2) J15.4
VHDCI1.VHDCI1_4_N: D39.6(I/O4) J15.39
VHDCI1.VHDCI1_4_P: D39.1(I/O1) J15.5
VHDCI1.VHDCI1_5_N: D39.4(I/O3) J15.40
VHDCI1.VHDCI1_5_P: D39.3(I/O2) J15.6
VHDCI1.VHDCI1_6_N: D40.6(I/O4) J15.41
VHDCI1.VHDCI1_6_P: D40.1(I/O1) J15.7
VHDCI1.VHDCI1_7_N: D40.4(I/O3) J15.42
VHDCI1.VHDCI1_7_P: D40.3(I/O2) J15.8
VHDCI1.VHDCI1_8_N: D37.4(I/O3) J15.36
VHDCI1.VHDCI1_8_P: D37.3(I/O2) J15.2
VHDCI1.VHDCI1_9_N: D41.4(I/O3) J15.44
VHDCI1.VHDCI1_9_P: D41.3(I/O2) J15.10
VHDCI1.VHDCI1_10_N: D42.6(I/O4) J15.45
VHDCI1.VHDCI1_10_P: D42.1(I/O1) J15.11
VHDCI1.VHDCI1_11_N: D42.4(I/O3) J15.46
VHDCI1.VHDCI1_11_P: D42.3(I/O2) J15.12
VHDCI1.VHDCI1_12_N: D43.6(I/O4) J15.47
VHDCI1.VHDCI1_12_P: D43.1(I/O1) J15.13
VHDCI1.VHDCI1_13_N: D43.4(I/O3) J15.48
VHDCI1.VHDCI1_13_P: D43.3(I/O2) J15.14
VHDCI1.VHDCI1_14_N: D44.6(I/O4) J15.49
VHDCI1.VHDCI1_14_P: D44.1(I/O1) J15.15
VHDCI1.VHDCI1_15_N: D44.4(I/O3) J15.50
VHDCI1.VHDCI1_15_P: D44.3(I/O2) J15.16
VHDCI1.VHDCI1_16_N: D45.4(I/O3) J15.54
VHDCI1.VHDCI1_16_P: D45.3(I/O2) J15.20
VHDCI1.VHDCI1_17_N: D45.6(I/O4) J15.53
VHDCI1.VHDCI1_17_P: D45.1(I/O1) J15.19
VHDCI1.VHDCI1_18_N: D49.6(I/O4) J15.61
VHDCI1.VHDCI1_18_P: D49.1(I/O1) J15.27
VHDCI1.VHDCI1_19_N: D46.4(I/O3) J15.56
VHDCI1.VHDCI1_19_P: D46.3(I/O2) J15.22
VHDCI1.VHDCI1_20_N: D47.6(I/O4) J15.57
VHDCI1.VHDCI1_20_P: D47.1(I/O1) J15.23
VHDCI1.VHDCI1_21_N: D47.4(I/O3) J15.58
VHDCI1.VHDCI1_21_P: D47.3(I/O2) J15.24
VHDCI1.VHDCI1_22_N: D48.6(I/O4) J15.59
VHDCI1.VHDCI1_22_P: D48.1(I/O1) J15.25
VHDCI1.VHDCI1_23_N: D48.4(I/O3) J15.60
VHDCI1.VHDCI1_23_P: D48.3(I/O2) J15.26
VHDCI1.VHDCI1_24_N: D46.6(I/O4) J15.55
VHDCI1.VHDCI1_24_P: D46.1(I/O1) J15.21
VHDCI1.VHDCI1_25_N: D49.4(I/O3) J15.62
VHDCI1.VHDCI1_25_P: D49.3(I/O2) J15.28
VHDCI1.VHDCI1_26_N: D50.6(I/O4) J15.63
VHDCI1.VHDCI1_26_P: D50.1(I/O1) J15.29
VHDCI1.VHDCI1_27_N: D50.4(I/O3) J15.64
VHDCI1.VHDCI1_27_P: D50.3(I/O2) J15.30
VHDCI1.VHDCI1_28_N: D51.6(I/O4) J15.65
VHDCI1.VHDCI1_28_P: D51.1(I/O1) J15.31
VHDCI1.VHDCI1_29_N: D51.4(I/O3) J15.66
VHDCI1.VHDCI1_29_P: D51.3(I/O2) J15.32
VHDCI1.VHDCI1_30_N: D52.6(I/O4) J15.67
VHDCI1.VHDCI1_30_P: D52.1(I/O1) J15.33
VHDCI1.VHDCI1_31_N: D52.4(I/O3) J15.68
VHDCI1.VHDCI1_31_P: D52.3(I/O2) J15.34
VHDCI1_SCL: D53.3(I/O2) J15.17 ; port VHDCI1_I2C.SCL  [project net SCL7]
VHDCI1_SDA: D53.4(I/O3) J15.51 ; port VHDCI1_I2C.SDA  [project net SDA7]
VHDCI_SUP1: F3.1 J14.52
VHDCI_SUP2: F2.1 J15.52

### Buses and harness runs
harness VHDCI0 = port VHDCI0
harness VHDCI1 = port VHDCI1

### Layout directives
net class LVDS: (no net found under the mark)

### Notes on the sheet
- C
- Interfaces with:
- Impedance: 100Ohm diff
- diff lines: LVDS or LVCMOS18
- PCB_3U_VHDCI_Baseboard
- control signals: 3.3V LVCMOS
- Project/Equipment
- Document
- Designer
- Drawn by
- Check.by
- Copyright WUT ISE 2018.
  This documentation describes Open Hardware and is licensed under the CERN OHL v.1.1. You may redistribute and modify this documentation under the terms of the CERN OHL v.1.1. (http://ohwr.org/CERNOHL). This documentation is distributed WITHOUT ANY EXPRESS OR IMPLIED WARRANTY, INCLUDING OF MERCHANTABILITY, SATISFACTORY QUALITY AND FITNESS FOR A PARTICULAR PURPOSE. Please see the CERN OHL v.1.1 for applicable conditions.
- Contact
- File
- Last Mod.
- Print Date
- Sheet
- Size
- A3
- of
- Rev

### Library data of the parts
C141-C146 = CC0201_100NF_6.3V_10%_X5R: as C10 on sheet Metlino_CLK_Distribution; Manufacturer Part Number: CC0201_100NF_6.3V_10%_X5R; Part Number: CC0201_100NF_6.3V_10%_X5R; Value: 100nF; Component Kind: Standard; Component Type: Standard; Pin Count: 2; Status: Not Recommended; Case: 0201; Mounted: Yes; Socket: No; SMD: Yes; Sense: No; Manufacturer1 Example: AVX; Manufacturer1 ComponentHeight: 0.33mm; HelpURL: \\cern.ch\dfs\Applications\Altium\Datasheets\CC0201_X5R_AVX.pdf; Author: CERN DEM JLC; CreateDate: 03.12.2007; LatestRevisionDate: 03.12.2007
D21-D53 = NUP4114UPXV6T1G: Manufacturer: ON SEMICONDUCTOR; Part Description: ESD Protection Diodes Array (8kV) with Low Clamping Voltage; Voltage: 5.5V; PressFit: No; Bonding: No; Manufacturer Part Number: NUP4114UPXV6T1G; PackageDescription: SOTFL (SOT666, SOT563,), 0.50mm, Pitch; 6 Pin, 1.20mm W X 1.60mm L X 0.60mm H Body, IPC Medium Density; Part Number: NUP4114UPXV6T1G; Component Kind: Standard; Component Type: Standard; Device: NUP4114UPXV6T1G; Pin Count: 8; Mounted: Yes; Socket: No; SMD: Yes; Sense: No; ComponentHeight: 1.75mm; HelpURL: \\cern.ch\dfs\Applications\Altium\Datasheets\NUP4114UPXV6T1G.pdf; Author: CERN DEM JLC; CreateDate: 05.12.2012; LatestRevisionDate: 05.12.2012
F2 F3 = FUSR_LITTELFUSE_0805L010YR: Fuse; Part Description: POLYFUSE® Surface Mount Resettable PTC; PressFit: No; Manufacturer Part Number: 0805L010YR; Manufacturer: LITTELFUSE; PackageDescription: Surface Mount POLY-FUSE® Resettable PTC, 0805L Series; Part Number: FUSR_LITTELFUSE_0805L010YR; Value: 100mA-15V; Component Kind: Standard; Component Type: Standard; Pin Count: 2; Family: Fuses Resettable; Mounted: Yes; Socket: No; SMD: Yes; Sense: No; ComponentHeight: 1mm; HelpURL: \\cern.ch\dfs\Applications\Altium\Datasheets\FUSR_LITTELFUSE_0805L010YR.pdf; Author: CERN DEM JLC; CreateDate: 11.09.2012; LatestRevisionDate: 11.09.2012
J14 J15 = MOLEX_71430-0013: Very High Density Cable Interconnect (VHDCI ) 68 Female; Manufacturer: MOLEX; Part Description: 68 Positions, Pitch 0.8mm, Very Hight Density Right Angle Receptacle, VHDCI Standard (Recommended PCB Thickness: 1.6mm); PressFit: No; Manufacturer Part Number: 71430-0013; Part Number: MOLEX_71430-0013; Component Kind: Standard; Component Type: Standard; Pin Count: 70; Family: VHDCI; Mounted: Yes; Socket: No; SMD: No; Sense: No; Status: None; ComponentHeight: 6.28mm; HelpURL: \\cern.ch\dfs\Applications\Altium\Datasheets\MOLEX_71430-0013.pdf; Author: CERN DEM JLC; CreateDate: 30.01.2014; LatestRevisionDate: 30.01.2014